# Altium schematic sheet rf_receive.SchDoc
size A; SheetNumber: 16; SheetTotal: 17
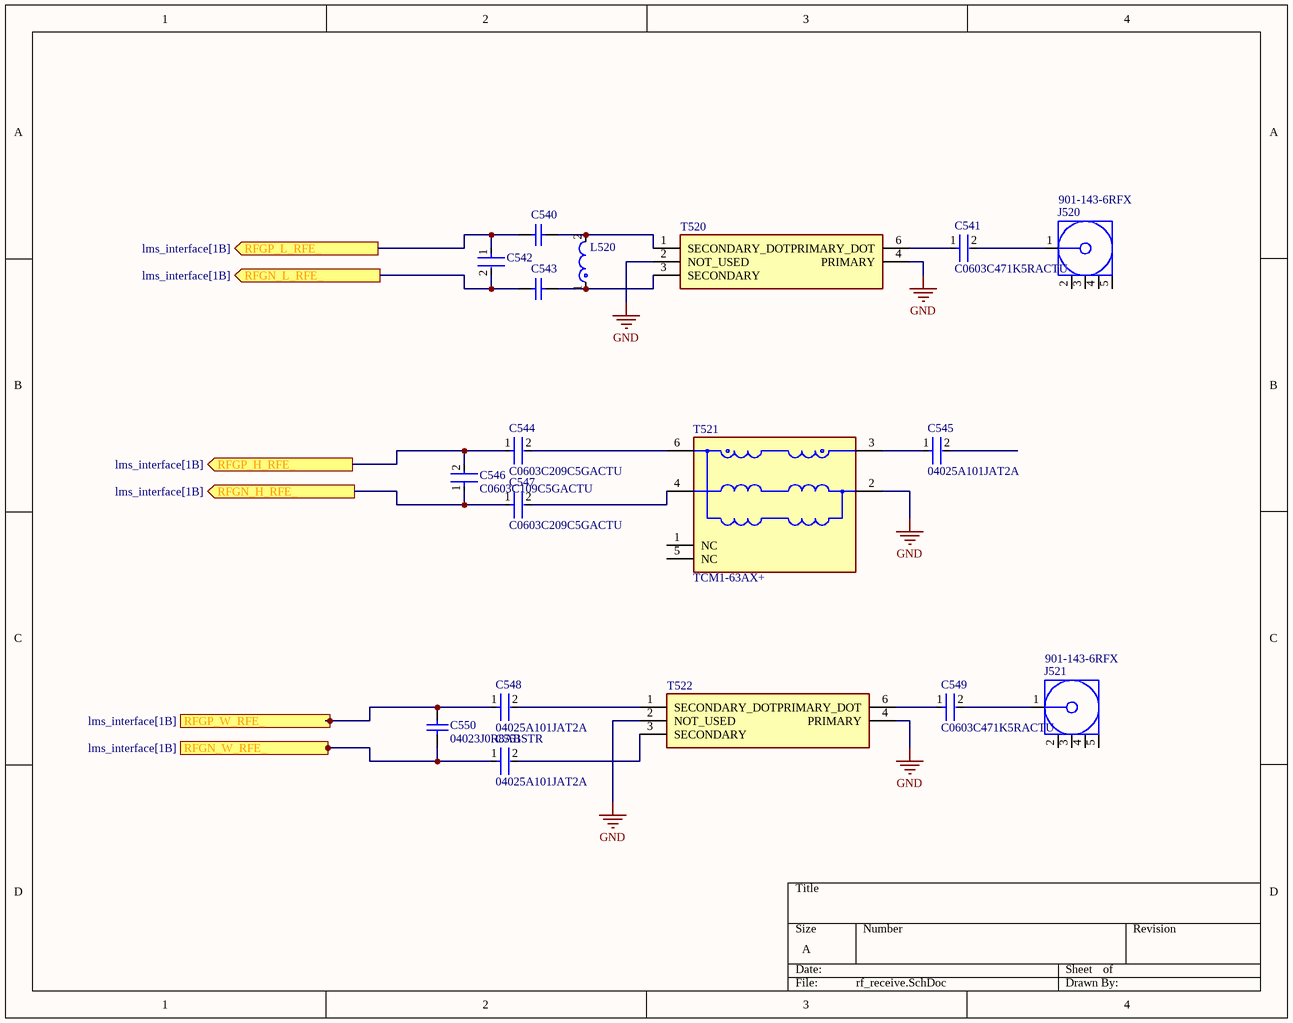
[diagram p0: rf_receive.SchDoc]

## Parts
C540  08055A511JAT2A  [CAPC2013X94X50LL20T25]  (value not drawn)
C541  C0603C471K5RACTU  [FP-C0603C-CF-MFG]
C542  GJM1555C1H1R2BB01D  [FP-GJM155-0_05-IPC_B]  (value not drawn)
C543  08055A511JAT2A  [CAPC2013X94X50LL20T25]  (value not drawn)
C544  C0603C209C5GACTU  [FP-C0603C-CF-MFG]
C545  04025A101JAT2A  [FP-0402-L_1_0_1-W_0_5_0_1-MFG]
C546  C0603C109C5GACTU  [FP-C0603C-CF-MFG]
C547  C0603C209C5GACTU  [FP-C0603C-CF-MFG]
C548  04025A101JAT2A  [FP-0402-L_1_0_1-W_0_5_0_1-MFG]
C549  C0603C471K5RACTU  [FP-C0603C-CF-MFG]
C550  04023J0R8ABSTR  [CAPC1006X50X20NL10T10]
C551  04025A101JAT2A  [FP-0402-L_1_0_1-W_0_5_0_1-MFG]
J520  901-143-6RFX  [AMPH-901-143-6RFX_V]
J521  901-143-6RFX  [AMPH-901-143-6RFX_V]
L520  LQG15HN8N2J02D  [FP-LQG15HH_02-MFG]  (value not drawn)
T520  TC1-1-13MA+  [TC1113MA]  (value not drawn)
T521  TCM1-63AX+  [FP-TCM1-63AX+-MFG]
T522  TC1-1-13MA+  [TC1113MA]  (value not drawn)

## Ports
RFGN_H_RFE_ (out, see lms_interface[1B]), RFGN_L_RFE_ (out, see lms_interface[1B]), RFGN_W_RFE_ (out, see lms_interface[1B]), RFGP_H_RFE_ (out, see lms_interface[1B]), RFGP_L_RFE_ (out, see lms_interface[1B]), RFGP_W_RFE_ (out, see lms_interface[1B])

## Nets
GND: T520.2(NOT_USED) T520.4(PRIMARY) T521.2(GND) T522.2(NOT_USED) T522.4(PRIMARY)
RFGN_H_RFE_: C546.1 C547.1 ; port RFGN_H_RFE_
RFGN_L_RFE_: C542.2 C543.1 ; port RFGN_L_RFE_
RFGN_W_RFE_: C550.1 C551.1 ; port RFGN_W_RFE_
RFGP_H_RFE_: C544.1 C546.2 ; port RFGP_H_RFE_
RFGP_L_RFE_: C540.1 C542.1 ; port RFGP_L_RFE_
RFGP_W_RFE_: C548.1 C550.2 ; port RFGP_W_RFE_
NetC540_2: C540.2 L520.2 T520.1(SECONDARY_DOT)
NetC541_1: C541.1 T520.6(PRIMARY_DOT)
NetC541_2: C541.2 J520.1
NetC543_2: C543.2 L520.1 T520.3(SECONDARY)
NetC544_2: C544.2 T521.6(SECONDARY_DOT)
NetC545_1: C545.1 T521.3(PRIMARY_DOT)
NetC547_2: C547.2 T521.4(SECONDARY)
NetC548_2: C548.2 T522.1(SECONDARY_DOT)
NetC549_1: C549.1 T522.6(PRIMARY_DOT)
NetC549_2: C549.2 J521.1
NetC551_2: C551.2 T522.3(SECONDARY)

Not connected (* = marked no-connect by the designer): C545 2; J520 2 3 4 5; J521 2 3 4 5; T521 1(NC) 5(NC)

## Library data of the parts
C540 C543 = CMP-2007-04331-1: Manufacturer: AVX Interconnect / Elco; Part Number: 08055A511JAT2A
C541 C549 = CMP-2006-03816-2: CAP CER 470PF 50V X7R 0603; Manufacturer: KEMET; Tolerance: 0.1; Temperature Coefficient: 30ppm/°C; Material: Ceramic; Automotive Grade: Grade 1; Description: C0603 470 pF X7R 30ppm/°C 10.00% 50 V; Capacitance: 470 pF; Manufacturer Part Number: C0603C471K5RACTU; Temperature Characteristic: X7R; Mouser Description: Ceramic Capacitor, 470Pf, 50V, X7R, 10%, 0603, Full Reel; Height: 0.87mm; Temperature: -55°C to +125°C; RoHS: TRUE; Lead Free: Yes; Category: Cap; ComponentLink2URL: https://api.kemet.com/component-edge/download/datasheet/C0603C100J5GACAUTO.pdf; Device Class L3: Ceramic Capacitors; Temperature Range High: +125°C; Package: C0603C-CF; Automotive: Yes; Device Class L2: Capacitors; Device Class L1: Passive Components; Value: 470 pF; Digikey Description: CAP CER 470PF 50V X7R 0603; Temperature Range Low: -55°C; ComponentLink2Description: Datasheet; Voltage Rating: 50 V; Octopart: https://octopart.com/c0603c471k5ractu-kemet-89311
C542 = CMP-2008-03813-2: Multi-Layer Ceramic Capacitor 1.2pF C0G  ±0.1pF 0402 Paper T/R; Voltage Rating (DC): 50V; Temperature Coefficient: 30ppm/°C; Case Code (Metric): 1005; Lead Free: Lead Free; Packaging: Tape and Reel; Radiation Hardening: No; Dielectric: C0G; Case Code (Imperial): 0402; Weight: 2.3E-05oz; Width: 0.5mm; Case/Package: 0402; Length: 1mm; Voltage Rating: 50V; Number of Pins: 2; Depth: 0.5mm; Thickness: 0.022inch; Voltage: 50V; Package Quantity: 10000; Max Operating Temperature: 125°C; Height: 0.5mm; REACH SVHC: No SVHC; Capacitance: 1.2pF; Mount: Surface Mount; Min Operating Temperature: -55°C; Termination: SMD/SMT; Lead Pitch: 0.3mm
C544 C547 = CMP-1035-00141-3: CAP CER 2PF 50V C0G/NP0 0603; Manufacturer: KEMET; Tolerance: 0.25 pF; Value: 2.0 pF; Automotive Grade: Grade 1; Description: C0603 2.0 pF C0G 30ppm/°C 0.25 pF 50 V; Temperature Characteristic: C0G; Material: Ceramic; Temperature Coefficient: 30ppm/°C; Lead Free: Yes; Automotive: Yes; Temperature Range Low: -55°C; Capacitance: 2.0 pF; ComponentLink2URL: https://api.kemet.com/component-edge/download/datasheet/C0603C100J5GACAUTO.pdf; Octopart: https://octopart.com/c0603c209c5gactu-kemet-193083; Device Class L3: Ceramic Capacitors; Temperature: -55°C to +125°C; Height: 0.87mm; RoHS: TRUE; ComponentLink2Description: Datasheet; Temperature Range High: +125°C; Package: C0603C-CF; Category: Cap; Manufacturer Part Number: C0603C209C5GACTU; Voltage Rating: 50 V; Device Class L2: Capacitors; Mouser Description: Multilayer Ceramic Capacitors MLCC - SMD/SMT 50volts 2.0pF C0G 0.25%; Digikey Description: CAP CER 2PF 50V C0G/NP0 0603; Device Class L1: Passive Components
C545 C548 C551 = CMP-2008-02568-3: General Purpose Ceramic Capacitor, 0402, 100pF, 5%, C0G, 30ppm/°C, 50V; Insulation Resistance: 1GR; Dissipation Factor: 2.5%; REACH SVHC: No SVHC; Termination: SMD/SMT; Construction: Flat; Voltage: 50V; Contact Plating: Tin; Width: 0.02inch; Series: -; Voltage Rating (DC): 50V; Voltage Rating: 50V; Height: 0.56mm; Tolerance: 5%; Dielectric: C0G; Max Operating Temperature: 125°C; Length: 1mm; Lead Free: Lead Free; Case/Package: 0402; Min Operating Temperature: -55°C; Depth: 0.5mm; Case Code (Metric): 1005; Thickness: 0.022inch; Radiation Hardening: No; Temperature Coefficient: 30ppm/°C; Case Code (Imperial): 0402; Mount: Surface Mount; Capacitance: 100pF; Packaging: Tape and Reel; Package Quantity: 1; RoHS Compliant: Yes
C546 = CMP-2006-03328-2: CAP CER 1PF 50V C0G/NP0 0603; Manufacturer: KEMET; Value: 1.0 pF; Temperature Characteristic: C0G; Tolerance: 0.25 pF; Temperature Coefficient: 30ppm/°C; Description: C0603 1.0 pF C0G 30ppm/°C 0.25 pF 50 V; Automotive Grade: Grade 1; Material: Ceramic; Device Class L1: Passive Components; Temperature Range High: +125°C; Temperature: -55°C to +125°C; Height: 0.87mm; Digikey Description: CAP CER 1PF 50V C0G/NP0 0603; Voltage Rating: 50 V; ComponentLink2Description: Datasheet; Capacitance: 1.0 pF; Lead Free: Yes; ComponentLink2URL: https://api.kemet.com/component-edge/download/datasheet/C0603C100J5GACAUTO.pdf; Mouser Description: Multilayer Ceramic Capacitors MLCC - SMD/SMT 50volts 1.0pF C0G 0.25%; Temperature Range Low: -55°C; Device Class L3: Ceramic Capacitors; Device Class L2: Capacitors; Automotive: Yes; RoHS: TRUE; Package: C0603C-CF; Category: Cap; Manufacturer Part Number: C0603C109C5GACTU; Octopart: https://octopart.com/c0603c109c5gactu-kemet-107248
C550 = CMP-2008-04729-1: Manufacturer: AVX Interconnect / Elco; Part Number: 04023J0R8ABSTR
J520 J521 = CMP-2000-05705-1: Coaxial connector, 50 Ohm, -65 to 165 degC, 5-Pin THD, RoHS, Bulk; Manufacturer: Amphenol; Catalog Drawings: 901-143-6RFXMountingHole; 3D Model: 901-143-6RFX.igs; Body Material: Brass; Connector Type: Jack,FemaleSocket; Shield Termination: Solder; Other Names: 901-143-6-RFX9011436RFXARFX1232; Online Catalog: SMA,RFX; Frequency - Max: 18GHz; Body Finish: Gold; Dielectric Material: Polytetrafluoroethylene(PTFE); Center Contact Material: BerylliumCopper; Impedance: 50Ohm; Connector Style: SMA; Mounting Technology: ThroughHole; Mounting Type: ThroughHole,RightAngle; Cable Group: -; Series: -; Package Description: 5-Pin Through Hole Device, Body 7 x 7 mm, Pitch 2.54 mm; Package Reference: 901-143-6RFX; Voltage Rating: -; Standard Package: 1; Fastening Type: Threaded; Housing Color: Gold; Datasheet URL: http://www.amphenolrf.com/downloads/dl/file/id/2712/product/3102/901_143_6rfx_customer_drawing.pdf; Family: CoaxialConnectors(RF); Contact Termination: Solder; Manufacturer URL: http://www.amphenol.com/; Operating Temperature: -65°C~165°C; Category: Connectors,Interconnects; Packaging: Bulk; Features: -; Center Contact Plating: Gold; Datasheet Version: Rev. C, 06/2010; Ingress Protection: -
L520 = CMP-06042-008586-1: Multilayer type RF Inductor 8.2nH ±5% 0.25Ω 500mA 0402; Core Material: Air; Shielding: Unshielded; Current Rating: 300mA; Test Frequency: 100MHz; Self Resonant Frequency: 3.6GHz; Q Factor: 8; DC Resistance (DCR): 330mR; Case/Package: 0402; Max Operating Temperature: 125°C; Military Standard: Not; Depth: 0.55mm; Lead Free: Lead Free; DC Current: 300mA; Length: 1mm; Height: 0.02inch; Width: 0.5mm; Termination: SMD/SMT; Max DC Current: 300mA; Min Operating Temperature: -55°C; Height - Seated (Max): 0.022inch; Radiation Hardening: No; Inductance: 8.2nH; Packaging: Tape and Reel; REACH SVHC: No SVHC; Case Code (Imperial): 0402; Package Quantity: 1; Tolerance: 5%; Case Code (Metric): 1005; Mount: Surface Mount; Inductance Tolerance: 5%
T520 T522 = TC1-1-13MA+: Transformer; Manufacturer_Name: Mini-Circuits; Datasheet Link: https://www.minicircuits.com/pdfs/TC1-1-13MA+.pdf; Height: 4.06mm; Manufacturer_Part_Number: TC1-1-13MA+; Mouser Part Number: 139-TC1-1-13MA; Mouser Price/Stock: https://www.mouser.co.uk/ProductDetail/Mini-Circuits/TC1-1-13MA%2b?qs=xZ%2FP%252Ba9zWqaQyucfPXsKqA%3D%3D
T521 = CMP-199822-000001-1: 1:1 CORE & WIRE Transformer, 10 - 6000 MHz, 50Ω; Manufacturer: Mini-Circuits; Insertion Loss: 1.16-1.8dB; Return Loss: 9.42-16.9dB; Lead Free: Yes; Device Class L3: unset; Temperature: -40°C to +85°C; Manufacturer Part Number: TCM1-63AX+; Frequency: 10-6000MHz; Device Class L2: Transformers; RoHS: TRUE; Octopart: https://octopart.com/tcm1-63ax%2B-mini-circuits-107315723; Temperature Range Low: -40°C; Category: Trans; Package: 0; ComponentLink2URL: https://www.minicircuits.com/pdfs/TCM1-63AX+.pdf; ComponentLink2Description: Datasheet; Automotive: No; Height: 4.06mm; Device Class L1: Passive Components; Temperature Range High: +85°C; Turns Ratio: 1:1